# Altium schematic sheet system_control.SchDoc
size A4; SheetNumber: 2; SheetTotal: 13
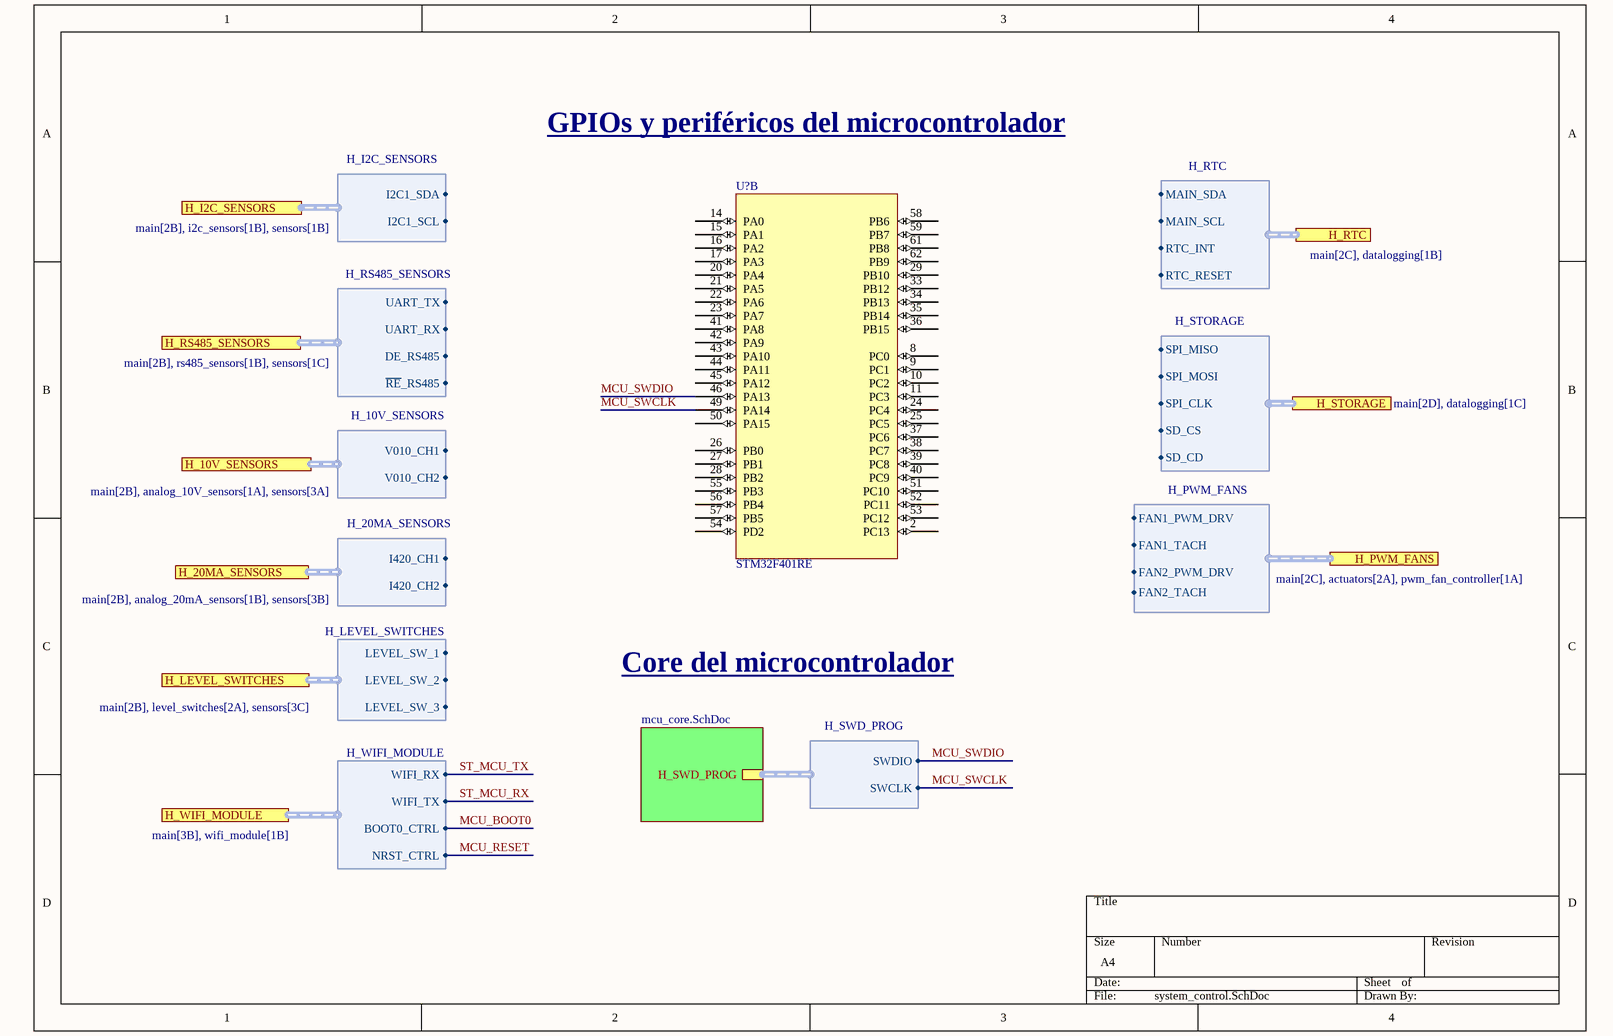
[diagram p0: system_control.SchDoc]

## Parts
U?  STM32F401RE  [FP-LQFP64-5W-IPC_B]  (part B of 2)

## Sub-sheets
mcu_core = mcu_core.SchDoc: H_SWD_PROG (harness H_SWD_PROG)

## Ports
H_10V_SENSORS (harness H_10V_SENSORS, see main[2B], analog_10V_sensors[1A], sensors[3A]), H_20MA_SENSORS (harness H_20MA_SENSORS, see main[2B], analog_20mA_sensors[1B], sensors[3B]), H_I2C_SENSORS (harness H_I2C_SENSORS, see main[2B], i2c_sensors[1B], sensors[1B]), H_LEVEL_SWITCHES (harness H_LEVEL_SWITCHES, see main[2B], level_switches[2A], sensors[3C]), H_PWM_FANS (harness H_PWM_FANS, see main[2C], actuators[2A], pwm_fan_controller[1A]), H_RS485_SENSORS (harness H_RS485_SENSORS, see main[2B], rs485_sensors[1B], sensors[1C]), H_RTC (harness H_RTC, see main[2C], datalogging[1B]), H_STORAGE (harness H_STORAGE, see main[2D], datalogging[1C]), H_WIFI_MODULE (harness H_WIFI_MODULE, see main[3B], wifi_module[1B])

## Harnesses
H_I2C_SENSORS: I2C1_SDA, I2C1_SCL
H_LEVEL_SWITCHES: LEVEL_SW_1, LEVEL_SW_2, LEVEL_SW_3
H_SWD_PROG: SWDIO, SWCLK
H_RTC: MAIN_SDA, MAIN_SCL, RTC_INT, RTC_RESET
H_STORAGE: SPI_MISO, SPI_MOSI, SPI_CLK, SD_CS, SD_CD
H_RS485_SENSORS: UART_TX, UART_RX, DE_RS485, ~{RE}_RS485
H_10V_SENSORS: V010_CH1, V010_CH2
H_20MA_SENSORS: I420_CH1, I420_CH2
H_PWM_FANS: FAN1_PWM_DRV, FAN1_TACH, FAN2_PWM_DRV, FAN2_TACH
H_WIFI_MODULE: WIFI_TX, WIFI_RX, BOOT0_CTRL, NRST_CTRL

## Nets
MCU_BOOT0: port H_WIFI_MODULE.BOOT0_CTRL
MCU_RESET: port H_WIFI_MODULE.NRST_CTRL
MCU_SWCLK: U?.49(PA14) ; sheet mcu_core/H_SWD_PROG.SWCLK
MCU_SWDIO: U?.46(PA13) ; sheet mcu_core/H_SWD_PROG.SWDIO
ST_MCU_RX: port H_WIFI_MODULE.WIFI_TX
ST_MCU_TX: port H_WIFI_MODULE.WIFI_RX

Not connected (* = marked no-connect by the designer): U? 2(PC13) 8(PC0) 9(PC1) 10(PC2) 11(PC3) 14(PA0) 15(PA1) 16(PA2) 17(PA3) 20(PA4) 21(PA5) 22(PA6) 23(PA7) 24(PC4) 25(PC5) 26(PB0) 27(PB1) 28(PB2) 29(PB10) 33(PB12) 34(PB13) 35(PB14) 36(PB15) 37(PC6) 38(PC7) 39(PC8) 40(PC9) 41(PA8) 42(PA9) 43(PA10) 44(PA11) 45(PA12) 50(PA15) 51(PC10) 52(PC11) 53(PC12) 54(PD2) 55(PB3) 56(PB4) 57(PB5) 58(PB6) 59(PB7) 61(PB8) 62(PB9)

## Notes on the sheet
- GPIOs y periféricos del microcontrolador
- Core del microcontrolador